# Altium project GD32E103.PrjPcb
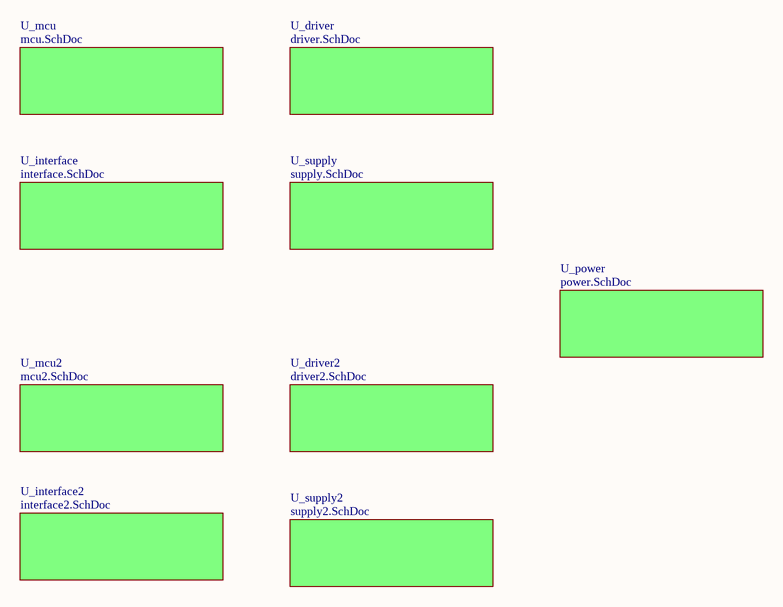
[diagram p0: GD30E103.SchDoc]
6 sheets, 250 parts. Net scope: global (net labels, ports and power ports of the same name join across sheets).
Board file: GD32E103.PcbDoc
Sheets:
  GD30E103.SchDoc
    U_mcu = mcu.SchDoc
    U_driver = driver.SchDoc
    U_interface = interface.SchDoc
    U_power = power.SchDoc
    U_supply = supply.SchDoc

## Sheet GD30E103.SchDoc
size A4

### Sub-sheets
U_driver = driver.SchDoc: no entries
U_driver2 = driver2.SchDoc (file not in this document): no entries
U_interface = interface.SchDoc: no entries
U_interface2 = interface2.SchDoc (file not in this document): no entries
U_mcu = mcu.SchDoc: no entries
U_mcu2 = mcu2.SchDoc (file not in this document): no entries
U_power = power.SchDoc: no entries
U_supply = supply.SchDoc: no entries
U_supply2 = supply2.SchDoc (file not in this document): no entries

## Sheet mcu.SchDoc
size A4
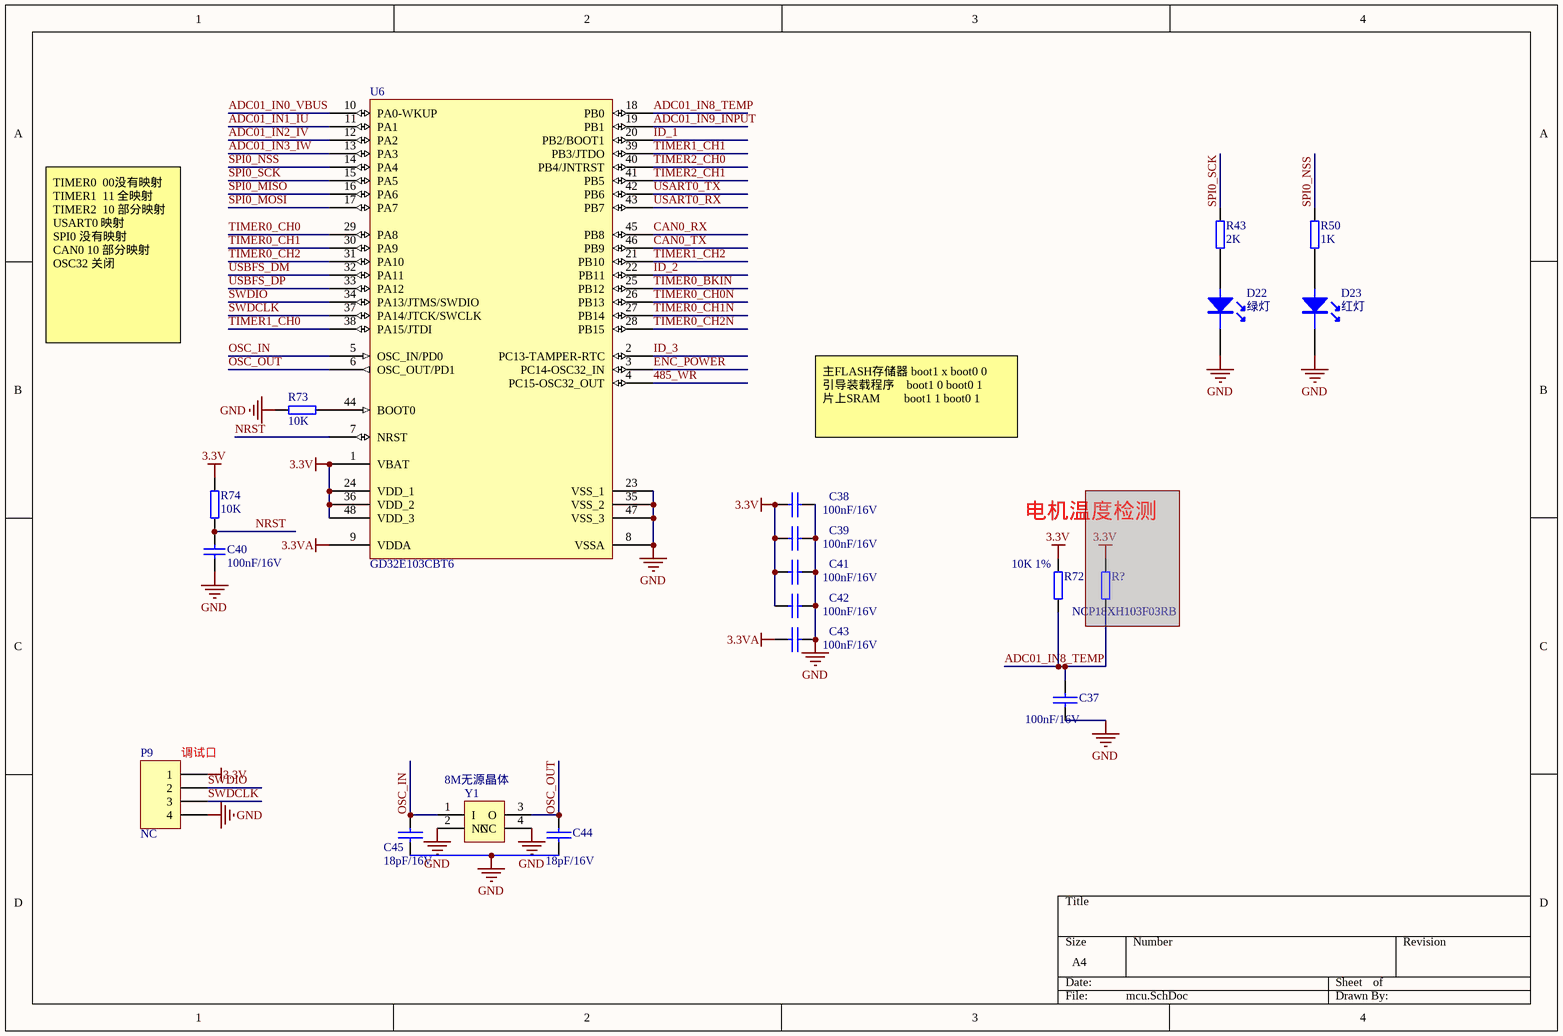
[diagram p1: mcu.SchDoc]

### Parts
C37  100nF/16V  [C0402]
C38  100nF/16V  [C0402]
C39  100nF/16V  [C0402]
C40  100nF/16V  [C0402]
C41  100nF/16V  [C0402]
C42  100nF/16V  [C0402]
C43  100nF/16V  [C0402]
C44  18pF/16V  [C0402]
C45  18pF/16V  [C0402]
D22  绿灯  [LED_0603]
D23  红灯  [LED_0603]
P9  NC  [2.0*4]
R43  2K  [R0402]
R50  1K  [R0402]
R72  10K 1%  [R0402]
R73  10K  [R0402]
R74  10K  [R0402]
R?  NCP18XH103F03RB  [R0603]  (masked out: inside a compile mask, not in the netlist)
U6  GD32E103CBT6  [LQFP-48]
Y1  8M无源晶体  [5032 4pin]

### Nets
3.3V: C38.2 C39.2 C41.2 C42.2 P9.1 R72.2 R74.2 U6.1(VBAT) U6.24(VDD_1) U6.36(VDD_2) U6.48(VDD_3)
3.3VA: C43.2 U6.9(VDDA)
GND: C37.2 C38.1 C39.1 C40.1 C41.1 C42.1 C43.1 C44.1 C45.1 D22.2(K) D23.2(K) P9.4 R73.1 U6.8(VSSA) U6.23(VSS_1) U6.35(VSS_2) U6.47(VSS_3) Y1.2(NC) Y1.4(NC)
485_WR: U6.4(PC15-OSC32_OUT)
ADC01_IN0_VBUS: U6.10(PA0-WKUP)
ADC01_IN1_IU: U6.11(PA1)
ADC01_IN2_IV: U6.12(PA2)
ADC01_IN3_IW: U6.13(PA3)
ADC01_IN8_TEMP: C37.1 R72.1 U6.18(PB0)
ADC01_IN9_INPUT: U6.19(PB1)
CAN0_RX: U6.45(PB8)
CAN0_TX: U6.46(PB9)
ENC_POWER: U6.3(PC14-OSC32_IN)
ID_1: U6.20(PB2/BOOT1)
ID_2: U6.22(PB11)
ID_3: U6.2(PC13-TAMPER-RTC)
NRST: C40.2 R74.1 U6.7(NRST)
OSC_IN: C45.2 U6.5(OSC_IN/PD0) Y1.1(I)
OSC_OUT: C44.2 U6.6(OSC_OUT/PD1) Y1.3(O)
SPI0_MISO: U6.16(PA6)
SPI0_MOSI: U6.17(PA7)
SPI0_NSS: R50.1 U6.14(PA4)
SPI0_SCK: R43.1 U6.15(PA5)
SWDCLK: P9.3 U6.37(PA14/JTCK/SWCLK)
SWDIO: P9.2 U6.34(PA13/JTMS/SWDIO)
TIMER0_BKIN: U6.25(PB12)
TIMER0_CH0: U6.29(PA8)
TIMER0_CH0N: U6.26(PB13)
TIMER0_CH1: U6.30(PA9)
TIMER0_CH1N: U6.27(PB14)
TIMER0_CH2: U6.31(PA10)
TIMER0_CH2N: U6.28(PB15)
TIMER1_CH0: U6.38(PA15/JTDI)
TIMER1_CH1: U6.39(PB3/JTDO)
TIMER1_CH2: U6.21(PB10)
TIMER2_CH0: U6.40(PB4/JNTRST)
TIMER2_CH1: U6.41(PB5)
USART0_RX: U6.43(PB7)
USART0_TX: U6.42(PB6)
USBFS_DM: U6.32(PA11)
USBFS_DP: U6.33(PA12)
NetD22_1: D22.1(A) R43.2
NetD23_1: D23.1(A) R50.2
NetR73_2: R73.2 U6.44(BOOT0)

### Notes on the sheet
- TIMER0  00没有映射
  TIMER1  11 全映射
  TIMER2  10 部分映射
  USART0 映射
  SPI0 没有映射
  CAN0 10 部分映射
  OSC32 关闭
- 主FLASH存储器 boot1 x boot0 0
  引导装载程序    boot1 0 boot0 1
  片上SRAM        boot1 1 boot0 1
- 电机温度检测
- (near P9) 调试口

### Library data of the parts
C37-C39 C41-C45 = CAP: Capacitor
C40 = cap
D22 = LED: 绿灯led
D23 = LED: 红灯led
P9 = 排针2mm,1*4: 空，无器件; LatestRevisionDate: 17-Jul-2002; LatestRevisionNote: Re-released for DXP Platform.; Publisher: Altium Limited
R43 R50 R72 = R
R73 R74 = Resistance
R? = R: 风华贴片NTC 120K 5%
U6 = GD32E103CxT6: Published: *; DatasheetVersion: *; PackageVersion: *; PackageReference: *; Publisher: *; PackageDescription: *; ComponentLink1Description: *; ComponentLink1URL: *; ComponentLink2Description: *; ComponentLink2URL: *
Y1 = OSC24

## Sheet driver.SchDoc
size A4
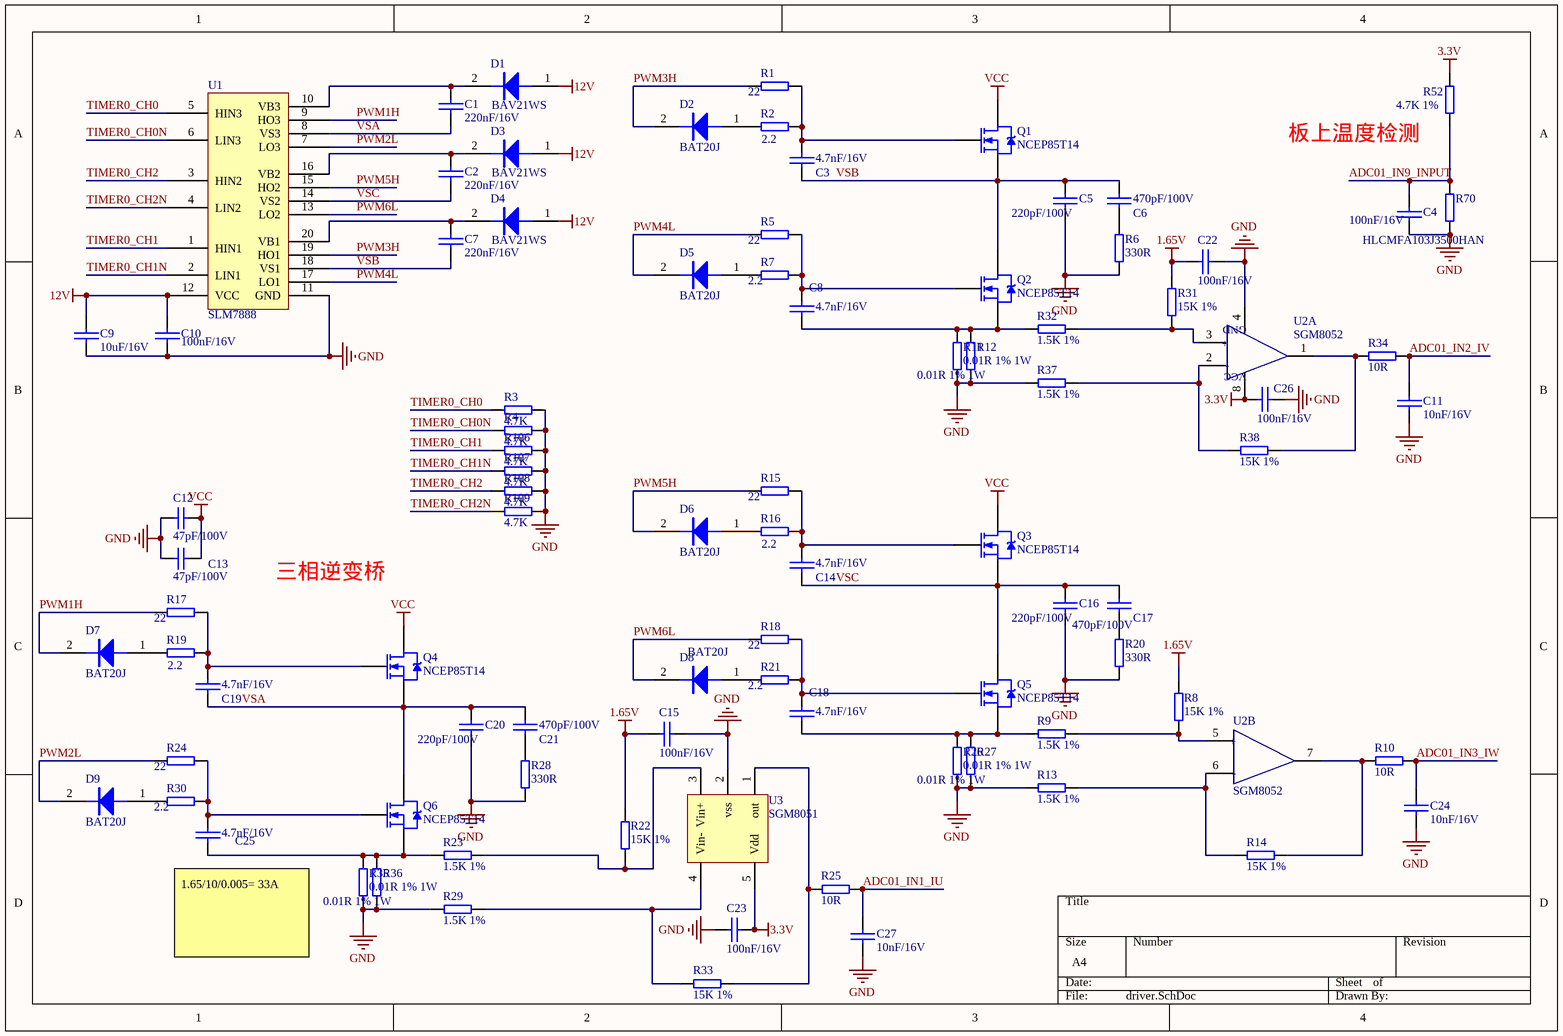
[diagram p2: driver.SchDoc]

### Parts
C1  220nF/16V  [C0402]
C2  220nF/16V  [C0402]
C3  4.7nF/16V  [C0402]
C4  100nF/16V  [C0402]
C5  220pF/100V  [C0805]
C6  470pF/100V  [C0805]
C7  220nF/16V  [C0402]
C8  4.7nF/16V  [C0402]
C9  10uF/16V  [C0805]
C10  100nF/16V  [C0603]
C11  10nF/16V  [C0402]
C12  47pF/100V  [C1206]
C13  47pF/100V  [C1206]
C14  4.7nF/16V  [C0402]
C15  100nF/16V  [C0402]
C16  220pF/100V  [C0805]
C17  470pF/100V  [C0805]
C18  4.7nF/16V  [C0402]
C19  4.7nF/16V  [C0402]
C20  220pF/100V  [C0805]
C21  470pF/100V  [C0805]
C22  100nF/16V  [C0402]
C23  100nF/16V  [C0402]
C24  10nF/16V  [C0402]
C25  4.7nF/16V  [C0402]
C26  100nF/16V  [C0402]
C27  10nF/16V  [C0402]
D1  BAV21WS  [SOD-323]
D2  BAT20J  [SOD-323]
D3  BAV21WS  [SOD-323]
D4  BAV21WS  [SOD-323]
D5  BAT20J  [SOD-323]
D6  BAT20J  [SOD-323]
D7  BAT20J  [SOD-323]
D8  BAT20J  [SOD-323]
D9  BAT20J  [SOD-323]
Q1  NCEP85T14  [TO-220ABN]
Q2  NCEP85T14  [TO-220ABN]
Q3  NCEP85T14  [TO-220ABN]
Q4  NCEP85T14  [TO-220ABN]
Q5  NCEP85T14  [TO-220ABN]
Q6  NCEP85T14  [TO-220ABN]
R1  22  [R0603]
R2  2.2  [R0603]
R3  4.7K  [R0402]
R4  4.7K  [R0402]
R5  22  [R0603]
R6  330R  [R1206]
R7  2.2  [R0603]
R8  15K 1%  [R0402]
R9  1.5K 1%  [R0402]
R10  10R  [R0402]
R11  0.01R 1% 1W  [R1210]
R12  0.01R 1% 1W  [R1210]
R13  1.5K 1%  [R0402]
R14  15K 1%  [R0402]
R15  22  [R0603]
R16  2.2  [R0603]
R17  22  [R0603]
R18  22  [R0603]
R19  2.2  [R0603]
R20  330R  [R1206]
R21  2.2  [R0603]
R22  15K 1%  [R0402]
R23  1.5K 1%  [R0402]
R24  22  [R0603]
R25  10R  [R0402]
R26  0.01R 1% 1W  [R1210]
R27  0.01R 1% 1W  [R1210]
R28  330R  [R1206]
R29  1.5K 1%  [R0402]
R30  2.2  [R0603]
R31  15K 1%  [R0402]
R32  1.5K 1%  [R0402]
R33  15K 1%  [R0402]
R34  10R  [R0402]
R35  0.01R 1% 1W  [R1210]
R36  0.01R 1% 1W  [R1210]
R37  1.5K 1%  [R0402]
R38  15K 1%  [R0402]
R52  4.7K 1%  [R0402]
R70  HLCMFA103J3500HAN  [R0603]
R106  4.7K  [R0402]
R107  4.7K  [R0402]
R108  4.7K  [R0402]
R109  4.7K  [R0402]
U1  SLM7888  [TSSOP-20]
U2  SGM8052  [VSSOP/MSOP-8]  (parts A,B of 2)
U3  SGM8051  [SOT-23(5)]

### Nets
1.65V: C15.2 C22.2 R8.1 R22.1 R31.1
3.3V: C23.2 C26.2 R52.2 U2.8(VCC) U3.5(Vdd)
12V: C9.2 C10.2 D1.1(A) D3.1(A) D4.1(A) U1.12(VCC)
GND: C4.2 C5.1 C9.1 C10.1 C11.2 C12.2 C13.2 C15.1 C16.1 C20.1 C22.1 C23.1 C24.2 C26.1 C27.2 R3.2 R4.2 R6.1 R11.2 R12.2 R13.2 R20.1 R26.2 R27.2 R28.1 R29.2 R35.2 R36.2 R37.2 R70.1 R106.2 R107.2 R108.2 R109.2 U1.11(GND) U2.4(GND) U3.2(vss)
VCC: C12.1 C13.1 Q1.3(D) Q3.3(D) Q4.3(D)
ADC01_IN1_IU: C27.1 R25.1
ADC01_IN2_IV: C11.1 R34.1
ADC01_IN3_IW: C24.1 R10.1
ADC01_IN9_INPUT: C4.1 R52.1 R70.2
PWM1H: D7.2(K) R17.2 U1.9(HO3)
PWM2L: D9.2(K) R24.2 U1.7(LO3)
PWM3H: D2.2(K) R1.2 U1.19(HO1)
PWM4L: D5.2(K) R5.2 U1.17(LO1)
PWM5H: D6.2(K) R15.2 U1.15(HO2)
PWM6L: D8.2(K) R18.2 U1.13(LO2)
TIMER0_CH0: R3.1 U1.5(HIN3)
TIMER0_CH0N: R4.1 U1.6(LIN3)
TIMER0_CH1: R106.1 U1.1(HIN1)
TIMER0_CH1N: R107.1 U1.2(LIN1)
TIMER0_CH2: R108.1 U1.3(HIN2)
TIMER0_CH2N: R109.1 U1.4(LIN2)
VSA: C1.1 C19.2 C20.2 C21.1 Q4.2(S) Q6.3(D) U1.8(VS3)
VSB: C3.2 C5.2 C6.1 C7.1 Q1.2(S) Q2.3(D) U1.18(VS1)
VSC: C2.1 C14.2 C16.2 C17.1 Q3.2(S) Q5.3(D) U1.14(VS2)
NetC1_2: C1.2 D1.2(K) U1.10(VB3)
NetC2_2: C2.2 D3.2(K) U1.16(VB2)
NetC3_1: C3.1 Q1.1(G) R1.1 R2.2
NetC6_2: C6.2 R6.2
NetC7_2: C7.2 D4.2(K) U1.20(VB1)
NetC8_1: C8.1 Q2.1(G) R5.1 R7.2
NetC8_2: C8.2 Q2.2(S) R11.1 R12.1 R32.2
NetC14_1: C14.1 Q3.1(G) R15.1 R16.2
NetC17_2: C17.2 R20.2
NetC18_1: C18.1 Q5.1(G) R18.1 R21.2
NetC18_2: C18.2 Q5.2(S) R9.2 R26.1 R27.1
NetC19_1: C19.1 Q4.1(G) R17.1 R19.2
NetC21_2: C21.2 R28.2
NetC25_1: C25.1 Q6.1(G) R24.1 R30.2
NetC25_2: C25.2 Q6.2(S) R23.2 R35.1 R36.1
NetD2_1: D2.1(A) R2.1
NetD5_1: D5.1(A) R7.1
NetD6_1: D6.1(A) R16.1
NetD7_1: D7.1(A) R19.1
NetD8_1: D8.1(A) R21.1
NetD9_1: D9.1(A) R30.1
NetR8_2: R8.2 R9.1 U2.5(+)
NetR10_2: R10.2 R14.1 U2.7(OUT2)
NetR13_1: R13.1 R14.2 U2.6(-)
NetR22_2: R22.2 R23.1 U3.3(Vin+)
NetR25_2: R25.2 R33.1 U3.1(out)
NetR29_1: R29.1 R33.2 U3.4(Vin-)
NetR31_2: R31.2 R32.1 U2.3(-)
NetR34_2: R34.2 R38.1 U2.1(OUT1)
NetR37_1: R37.1 R38.2 U2.2(-)

### Notes on the sheet
- 板上温度检测
- 三相逆变桥
- (near C25) 1.65/10/0.005= 33A

### Library data of the parts
C1-C11 C14-C27 = CAP: Capacitor
C12 C13 = cap
D1-D9 = DIODE
Q1-Q6 = N-channel Enhancement MOS
R1-R5 R7 R15-R19 R21 R24 R30 R52 R70 R106-R109 = R
R6 R8-R14 R20 R22 R23 R25-R29 R31-R38 = Resistance
U1 = SLM7888: SILLUMIN
U2 = LM393: 圣邦微电子
U3 = LMV7239: 圣邦微电子

## Sheet interface.SchDoc
size A4
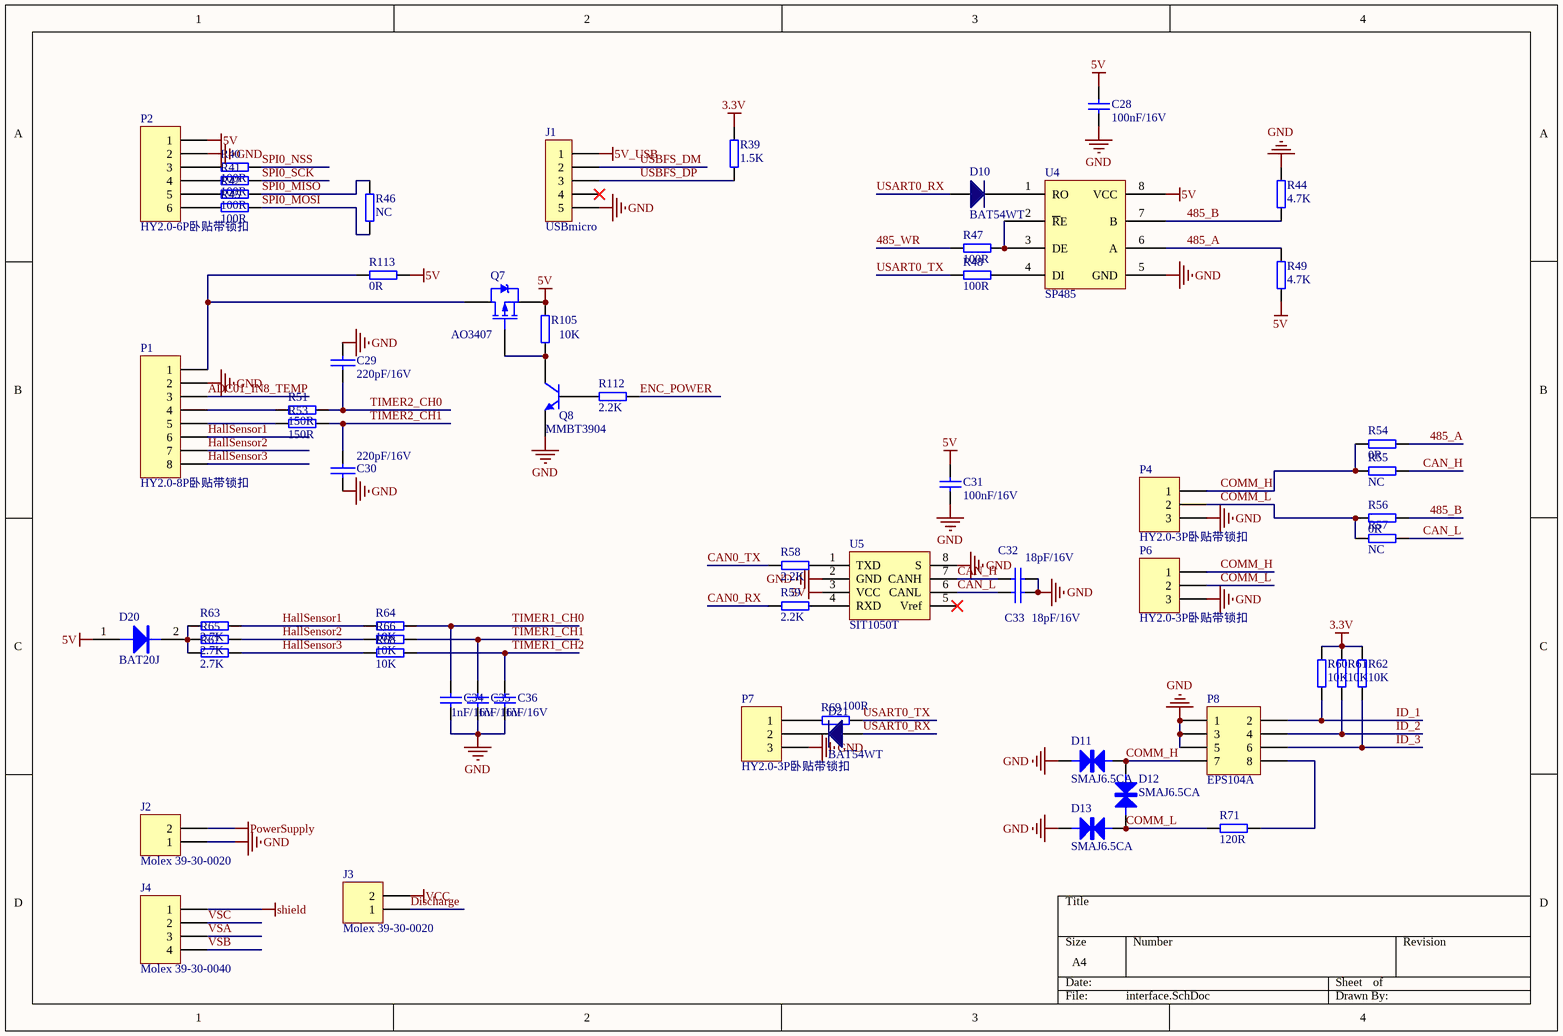
[diagram p3: interface.SchDoc]

### Parts
C28  100nF/16V  [C0402]
C29  220pF/16V  [C0402]
C30  220pF/16V  [C0402]
C31  100nF/16V  [C0402]
C32  18pF/16V  [C0402]
C33  18pF/16V  [C0402]
C34  1nF/16V  [C0402]
C35  1nF/16V  [C0402]
C36  1nF/16V  [C0402]
D10  BAT54WT  [SOD-523/SC-79]
D11  SMAJ6.5CA  [DO-214AC SMA]
D12  SMAJ6.5CA  [DO-214AC SMA]
D13  SMAJ6.5CA  [DO-214AC SMA]
D20  BAT20J  [SOD-323]
D21  BAT54WT  [SOD-523/SC-79]
J1  USBmicro  [USBmicro]
J2  Molex 39-30-0020  [Molex 39-30-0020]
J3  Molex 39-30-0020  [Molex 39-30-0020]
J4  Molex 39-30-0040  [Molex 39-30-0040]
P1  HY2.0-8P卧贴带锁扣  [2.0-8PIN 卧式]
P2  HY2.0-6P卧贴带锁扣  [2.0-6PIN 卧式]
P4  HY2.0-3P卧贴带锁扣  [2.0-3PIN 卧式]
P6  HY2.0-3P卧贴带锁扣  [2.0-3PIN 卧式]
P7  HY2.0-3P卧贴带锁扣  [2.0-3PIN 卧式]
P8  EPS104A  [EPG104A]
Q7  AO3407  [SOT-23]
Q8  MMBT3904  [SOT-23]
R39  1.5K  [R0402]
R40  100R  [R0402]
R41  100R  [R0402]
R42  100R  [R0402]
R44  4.7K  [R0402]
R45  100R  [R0402]
R46  NC  [R0603]
R47  100R  [R0402]
R48  100R  [R0402]
R49  4.7K  [R0402]
R51  150R  [R0402]
R53  150R  [R0402]
R54  0R  [R0603]
R55  NC  [R0603]
R56  0R  [R0603]
R57  NC  [R0603]
R58  2.2K  [R0402]
R59  2.2K  [R0402]
R60  10K  [R0402]
R61  10K  [R0402]
R62  10K  [R0402]
R63  2.7K  [R0402]
R64  10K  [R0402]
R65  2.7K  [R0402]
R66  10K  [R0402]
R67  2.7K  [R0402]
R68  10K  [R0402]
R69  100R  [R0402]
R71  120R  [R0603]
R105  10K  [R0402]
R112  2.2K  [R0402]
R113  0R  [R0805]
U4  SP485  [SOIC-8]
U5  SIT1050T  [SOIC-8]

### Nets
3.3V: R39.2 R60.2 R61.2 R62.2
5V: C28.1 C31.1 D20.1(A) P2.1 Q7.2(S) R49.1 R105.2 R113.2 U4.8(VCC) U5.3(VCC)
5V_USB: J1.1
GND: C28.2 C29.2 C30.1 C31.2 C32.1 C33.1 C34.2 C35.2 C36.2 D11.1(Anode) D13.1(Anode) J1.5 J2.1 P1.2 P2.2 P4.3 P6.3 P7.3 P8.1 P8.3 P8.5 Q8.2(E) R44.2 U4.5(GND) U5.2(GND) U5.8(S)
PowerSupply: J2.2
shield: J4.1
VCC: J3.2
485_A: R49.2 R54.1 U4.6(A)
485_B: R44.1 R56.1 U4.7(B)
485_WR: R47.2
ADC01_IN8_TEMP: P1.3
CAN0_RX: R59.2
CAN0_TX: R58.2
CAN_H: C32.2 R55.1 U5.7(CANH)
CAN_L: C33.2 R57.1 U5.6(CANL)
COMM_H: D11.2(Anode) D12.1(Anode) P4.1 P6.1 P8.7 R54.2 R55.2
COMM_L: D12.2(Anode) D13.2(Anode) P4.2 P6.2 R56.2 R57.2 R71.2
Discharge: J3.1
ENC_POWER: R112.2
HallSensor1: P1.6 R63.1 R64.1
HallSensor2: P1.7 R65.1 R66.1
HallSensor3: P1.8 R67.1 R68.1
ID_1: P8.2 R60.1
ID_2: P8.4 R61.1
ID_3: P8.6 R62.1
SPI0_MISO: R42.1 R46.1
SPI0_MOSI: R45.1 R46.2
SPI0_NSS: R40.1
SPI0_SCK: R41.1
TIMER1_CH0: C34.1 R64.2
TIMER1_CH1: C35.1 R66.2
TIMER1_CH2: C36.1 R68.2
TIMER2_CH0: C29.1 R51.2
TIMER2_CH1: C30.2 R53.2
USART0_RX: D10.1 D21.1
USART0_TX: R48.2 R69.1
USBFS_DM: J1.2
USBFS_DP: J1.3 R39.1
VSA: J4.3
VSB: J4.4
VSC: J4.2
NetD10_2: D10.2 U4.1(RO)
NetD20_2: D20.2(K) R63.2 R65.2 R67.2
NetD21_2: D21.2 P7.2
NetP1_1: P1.1 Q7.3(D) R113.1
NetP1_4: P1.4 R51.1
NetP1_5: P1.5 R53.1
NetP2_3: P2.3 R40.2
NetP2_4: P2.4 R41.2
NetP2_5: P2.5 R42.2
NetP2_6: P2.6 R45.2
NetP7_1: P7.1 R69.2
NetP8_8: P8.8 R71.1
NetQ7_1: Q7.1(G) Q8.3(C) R105.1
NetQ8_1: Q8.1(B) R112.1
NetR47_1: R47.1 U4.2(~{R}E) U4.3(DE)
NetR48_1: R48.1 U4.4(DI)
NetR58_1: R58.1 U5.1(TXD)
NetR59_1: R59.1 U5.4(RXD)

Not connected (* = marked no-connect by the designer): J1 4*; U5 5(Vref)*

### Library data of the parts
C28 C31-C36 = cap
C29 C30 = CAP: Capacitor
D10 D21 = Diode
D11-D13 = Bi-DIODES
D20 = DIODE
J1 = CON5: USB micro母座
J2 J3 = Header 2: Header, 2-Pin; LatestRevisionDate: 17-Jul-2002; LatestRevisionNote: Re-released for DXP Platform.; Publisher: Altium Limited
J4 = Header 4: Header, 4-Pin; LatestRevisionDate: 17-Jul-2002; LatestRevisionNote: Re-released for DXP Platform.; Publisher: Altium Limited
P1 = Header 8: LatestRevisionDate: 17-Jul-2002; LatestRevisionNote: Re-released for DXP Platform.; Publisher: Altium Limited
P2 = Header 6: LatestRevisionDate: 17-Jul-2002; LatestRevisionNote: Re-released for DXP Platform.; Publisher: Altium Limited
P4 P6 P7 = Header 3: LatestRevisionDate: 17-Jul-2002; LatestRevisionNote: Re-released for DXP Platform.; Publisher: Altium Limited
P8 = Header 4X2: 侧拨程式开关 2.54间距 4PIN 品牌：台湾ECE; LatestRevisionDate: 17-Jul-2002; LatestRevisionNote: Re-released for DXP Platform.; Publisher: Altium Limited
Q7 = P-channel Enhancement MOS
Q8 = NPN
R39-R42 R44-R49 R51 R53-R69 R71 R105 R112 R113 = Resistance
U5 = TJA1050

## Sheet power.SchDoc
size A4
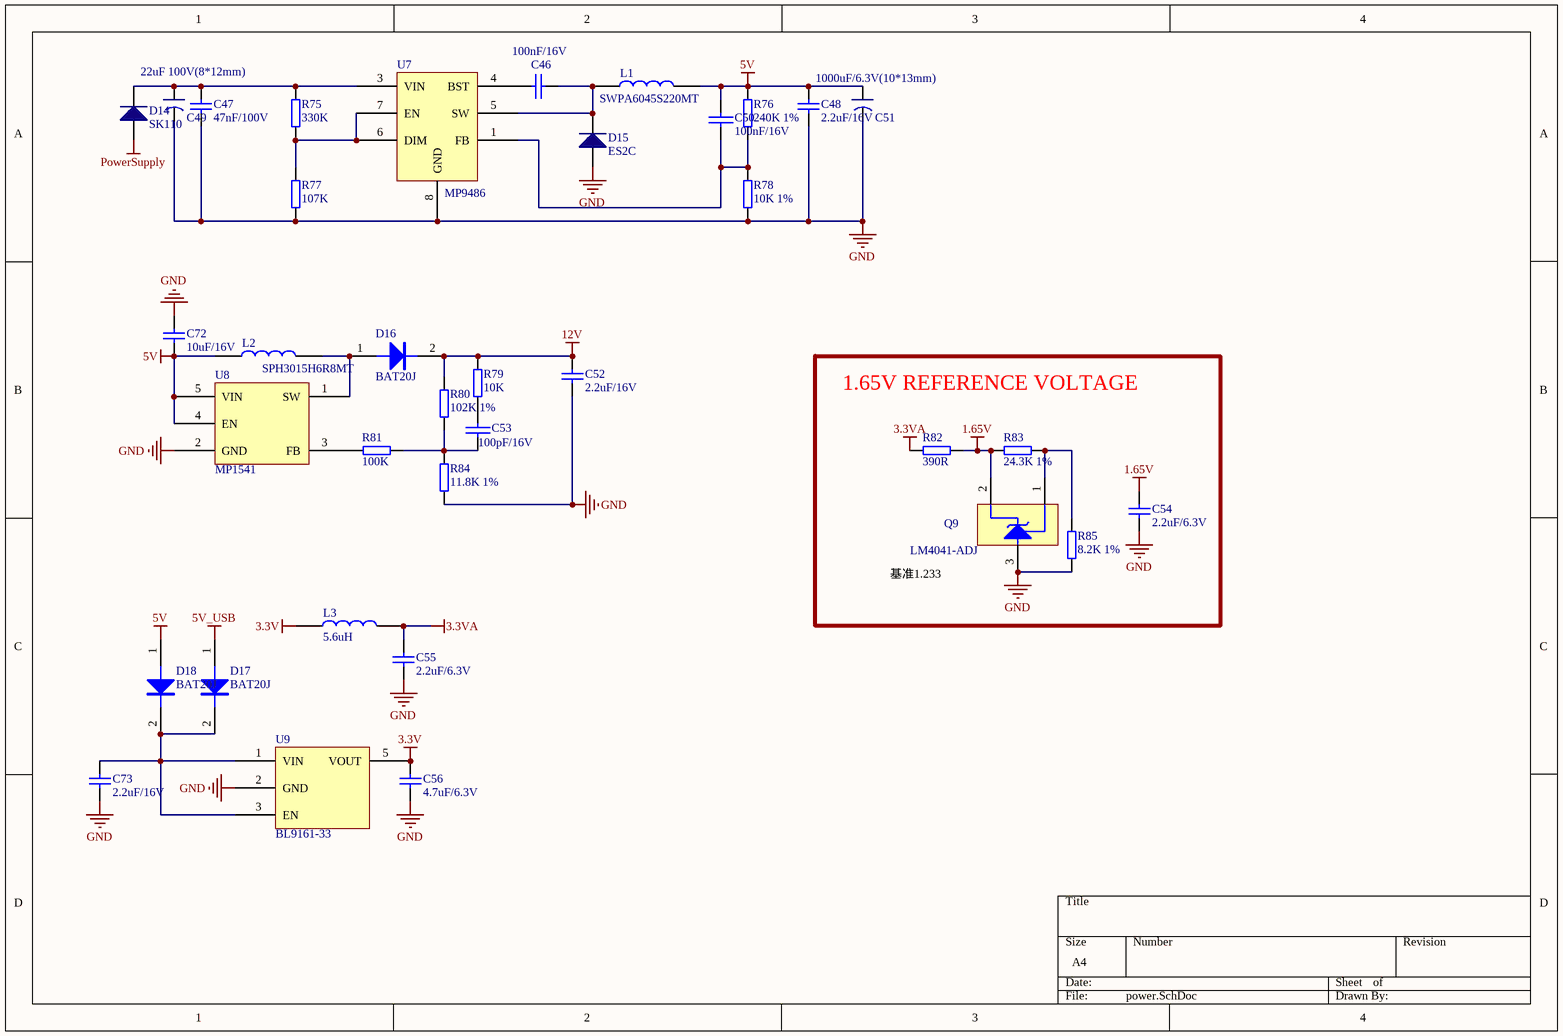
[diagram p4: power.SchDoc]

### Parts
C46  100nF/16V  [C0402]
C47  47nF/100V  [C1206]
C48  2.2uF/16V  [C0603]
C49  22uF 100V(8*12mm)  [AL-ELEC 8*12mm]
C50  100nF/16V  [C0402]
C51  1000uF/6.3V(10*13mm)  [AL-ELEC 10*13mm]
C52  2.2uF/16V  [C0603]
C53  100pF/16V  [C0402]
C54  2.2uF/6.3V  [C0402]
C55  2.2uF/6.3V  [C0402]
C56  4.7uF/6.3V  [C0603]
C72  10uF/16V  [C0805]
C73  2.2uF/16V  [C0603]
D14  SK110  [DO-214AC SMA]
D15  ES2C  [DO-214AA SMB]
D16  BAT20J  [SOD-323]
D17  BAT20J  [SOD-323]
D18  BAT20J  [SOD-323]
L1  SWPA6045S220MT  [SWPA6045S]
L2  SPH3015H6R8MT  [SPH3015]
L3  5.6uH  [L0402]
Q9  LM4041-ADJ  [SOT-23]
R75  330K  [R0402]
R76  240K 1%  [R0402]
R77  107K  [R0402]
R78  10K 1%  [R0402]
R79  10K  [R0402]
R80  102K 1%  [R0402]
R81  100K  [R0402]
R82  390R  [R0603]
R83  24.3K 1%  [R0402]
R84  11.8K 1%  [R0402]
R85  8.2K 1%  [R0402]
U7  MP9486  [SOIC-8 EP]
U8  MP1541  [SOT-23(5)]
U9  BL9161-33  [SOT-23(5)]

### Blocks framed on the sheet
1.65V REFERENCE VOLTAGE: C54 Q9 R82 R83 R85

### Nets
1.65V: C54.2 Q9.2 R82.2 R83.1
3.3V: C56.2 L3.1 U9.5(VOUT)
3.3VA: C55.2 L3.2 R82.1
5V: C48.2 C50.1 C51.1 C72.1 D18.1(A) L1.2 L2.1 R76.1 U8.4(EN) U8.5(VIN)
5V_USB: D17.1(A)
12V: C52.2 D16.2(K) R79.1 R80.1
GND: C47.1 C48.1 C49.2 C51.2 C52.1 C54.1 C55.1 C56.1 C72.2 C73.1 D15.1 Q9.3 R77.2 R78.2 R84.2 R85.2 U7.8(GND) U8.2(GND) U9.2(GND)
PowerSupply: D14.1
NetC46_1: C46.1 D15.2 L1.1 U7.5(SW)
NetC46_2: C46.2 U7.4(BST)
NetC47_2: C47.2 C49.1 D14.2 R75.1 U7.3(VIN)
NetC50_2: C50.2 R76.2 R78.1 U7.1(FB)
NetC53_1: C53.1 R80.2 R81.2 R84.1
NetC53_2: C53.2 R79.2
NetC73_2: C73.2 D17.2(K) D18.2(K) U9.1(VIN) U9.3(EN)
NetD16_1: D16.1(A) L2.2 U8.1(SW)
NetQ9_1: Q9.1 R83.2 R85.1
NetR75_2: R75.2 R77.1 U7.6(DIM) U7.7(EN)
NetR81_1: R81.1 U8.3(FB)

### Notes on the sheet
- (near Q9) 基准1.233

### Library data of the parts
C46 C50 C53 = CAP: Capacitor
C47 C48 C52 C54-C56 C72 C73 = cap
C49 C51 = Capacitor: 铝电解电容
D14 D15 = Diode
D16-D18 = DIODE
L1 = INDUCTOR: 顺络 22uH
L2 = INDUCTOR: 顺络 6.8uH
L3 = INDUCTOR: 贴片电感
Q9 = 3CCCCCC
R75-R85 = Resistance
U9 = BL9161

## Sheet supply.SchDoc
size A4
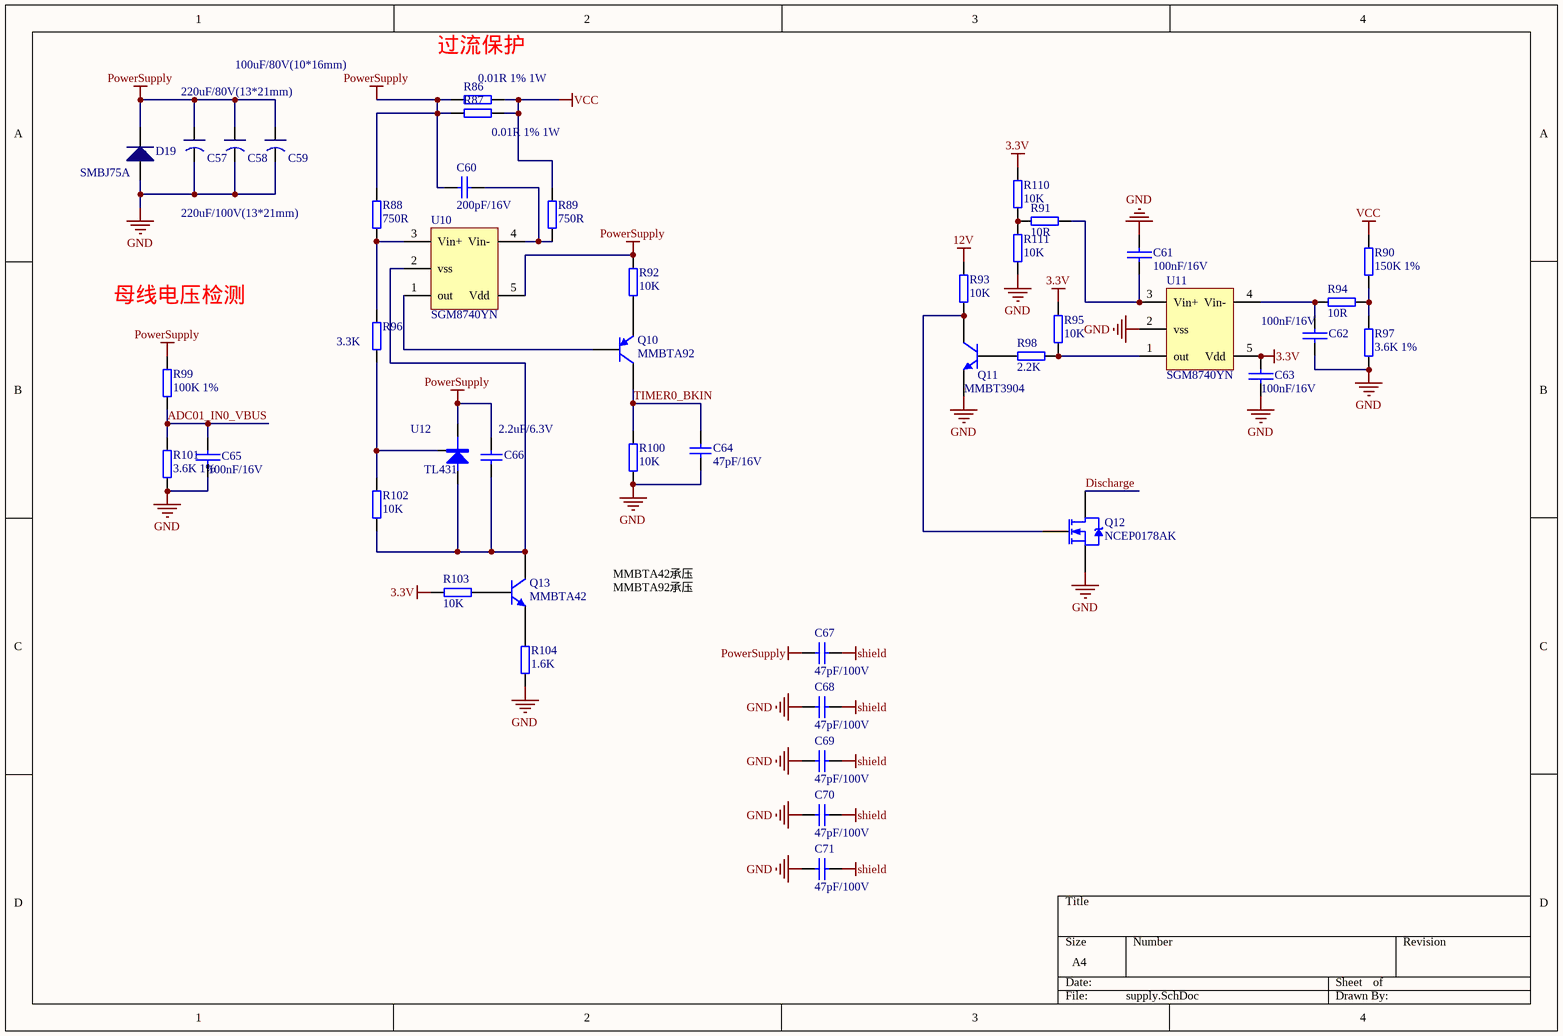
[diagram p5: supply.SchDoc]

### Parts
C57  220uF/80V(13*21mm)  [AL-ELEC 13*21mm]
C58  220uF/100V(13*21mm)  [AL-ELEC 13*21mm]
C59  100uF/80V(10*16mm)  [AL-ELEC 10*16mm]
C60  200pF/16V  [C0402]
C61  100nF/16V  [C0402]
C62  100nF/16V  [C0402]
C63  100nF/16V  [C0402]
C64  47pF/16V  [C0402]
C65  100nF/16V  [C0402]
C66  2.2uF/6.3V  [C0402]
C67  47pF/100V  [C1206]
C68  47pF/100V  [C1206]
C69  47pF/100V  [C1206]
C70  47pF/100V  [C1206]
C71  47pF/100V  [C1206]
D19  SMBJ75A  [DO-214AA SMB]
Q10  MMBTA92  [SOT-23]
Q11  MMBT3904  [SOT-23]
Q12  NCEP0178AK  [D-PAK(TO-252AA)]
Q13  MMBTA42  [SOT-23]
R86  0.01R 1% 1W  [R1210]
R87  0.01R 1% 1W  [R1210]
R88  750R  [R0402]
R89  750R  [R0402]
R90  150K 1%  [R0603]
R91  10R  [R0402]
R92  10K  [R0402]
R93  10K  [R0402]
R94  10R  [R0402]
R95  10K  [R0402]
R96  3.3K  [R0402]
R97  3.6K 1%  [R0603]
R98  2.2K  [R0402]
R99  100K 1%  [R0603]
R100  10K  [R0402]
R101  3.6K 1%  [R0603]
R102  10K  [R0402]
R103  10K  [R0402]
R104  1.6K  [R0402]
R110  10K  [R0402]
R111  10K  [R0402]
U10  SGM8740YN  [SOT-23(5)]
U11  SGM8740YN  [SOT-23(5)]
U12  TL431  [SOT-23]

### Nets
3.3V: C63.1 R95.2 R103.1 R110.2 U11.5(Vdd)
12V: R93.2
GND: C57.2 C58.2 C59.2 C61.2 C62.2 C63.2 C64.2 C65.2 C68.2 C69.2 C70.2 C71.2 D19.1 Q11.2(E) Q12.2(S) R97.1 R100.1 R101.1 R104.1 R111.1 U11.2(vss)
PowerSupply: C57.1 C58.1 C59.1 C60.2 C66.1 C67.2 D19.2 R86.2 R87.2 R88.2 R92.2 R99.2 U10.5(Vdd) U12.1(Cathode)
shield: C67.1 C68.1 C69.1 C70.1 C71.1
VCC: R86.1 R87.1 R89.2 R90.2
ADC01_IN0_VBUS: C65.1 R99.1 R101.2
Discharge: Q12.3(D)
TIMER0_BKIN: C64.1 Q10.3(C) R100.2
NetC60_1: C60.1 R89.1 U10.4(Vin-)
NetC61_1: C61.1 R91.1 U11.3(Vin+)
NetC62_1: C62.1 R94.2 U11.4(Vin-)
NetC66_2: C66.2 Q13.3(C) R102.2 U10.2(vss) U12.3(Anode)
NetQ10_1: Q10.1(B) U10.1(out)
NetQ10_2: Q10.2(E) R92.1
NetQ11_1: Q11.1(B) R98.1
NetQ11_3: Q11.3(C) Q12.1(G) R93.1
NetQ13_1: Q13.1(B) R103.2
NetQ13_2: Q13.2(E) R104.2
NetR88_1: R88.1 R96.1 U10.3(Vin+)
NetR90_1: R90.1 R94.1 R97.2
NetR91_2: R91.2 R110.1 R111.2
NetR95_1: R95.1 R98.2 U11.1(out)
NetR96_2: R96.2 R102.1 U12.2(REF)

### Notes on the sheet
- 过流保护
- 母线电压检测
- MMBTA42承压MMBTA92承压

### Library data of the parts
C57-C59 = Capacitor: 铝电解电容
C60 C64 C66-C71 = cap
C61-C63 C65 = CAP: Capacitor
D19 = Diode
Q10 = PNP
Q11 Q13 = NPN
Q12 = N-channel Enhancement MOS
R86-R104 R110 R111 = Resistance
U10 U11 = LMV7239: 圣邦微电子 丝印 SL5XX
U12 = TL431A: 注意引脚关系：1-C 2-R 3-A

## Nets that join several sheets
1.65V: driver (5 pins), power (C54.2 Q9.2 R82.2 R83.1)
3.3V: mcu (11 pins), driver (5 pins), interface (R39.2 R60.2 R61.2 R62.2), power (C56.2 L3.1 U9.5), supply (5 pins)
3.3VA: mcu (C43.2 U6.9), power (C55.2 L3.2 R82.1)
5V: interface (10 pins), power (10 pins)
5V_USB: interface (J1.1), power (D17.1)
12V: driver (6 pins), power (C52.2 D16.2 R79.1 R80.1), supply (R93.2)
GND: mcu (19 pins), driver (37 pins), interface (26 pins), power (19 pins), supply (21 pins)
PowerSupply: interface (J2.2), power (D14.1), supply (14 pins)
shield: interface (J4.1), supply (5 pins)
VCC: driver (5 pins), interface (J3.2), supply (R86.1 R87.1 R89.2 R90.2)
485_WR: mcu (U6.4), interface (R47.2)
ADC01_IN0_VBUS: mcu (U6.10), supply (C65.1 R99.1 R101.2)
ADC01_IN1_IU: mcu (U6.11), driver (C27.1 R25.1)
ADC01_IN2_IV: mcu (U6.12), driver (C11.1 R34.1)
ADC01_IN3_IW: mcu (U6.13), driver (C24.1 R10.1)
ADC01_IN8_TEMP: mcu (C37.1 R72.1 U6.18), interface (P1.3)
ADC01_IN9_INPUT: mcu (U6.19), driver (C4.1 R52.1 R70.2)
CAN0_RX: mcu (U6.45), interface (R59.2)
CAN0_TX: mcu (U6.46), interface (R58.2)
Discharge: interface (J3.1), supply (Q12.3)
ENC_POWER: mcu (U6.3), interface (R112.2)
ID_1: mcu (U6.20), interface (P8.2 R60.1)
ID_2: mcu (U6.22), interface (P8.4 R61.1)
ID_3: mcu (U6.2), interface (P8.6 R62.1)
SPI0_MISO: mcu (U6.16), interface (R42.1 R46.1)
SPI0_MOSI: mcu (U6.17), interface (R45.1 R46.2)
SPI0_NSS: mcu (R50.1 U6.14), interface (R40.1)
SPI0_SCK: mcu (R43.1 U6.15), interface (R41.1)
TIMER0_BKIN: mcu (U6.25), supply (C64.1 Q10.3 R100.2)
TIMER0_CH0: mcu (U6.29), driver (R3.1 U1.5)
TIMER0_CH0N: mcu (U6.26), driver (R4.1 U1.6)
TIMER0_CH1: mcu (U6.30), driver (R106.1 U1.1)
TIMER0_CH1N: mcu (U6.27), driver (R107.1 U1.2)
TIMER0_CH2: mcu (U6.31), driver (R108.1 U1.3)
TIMER0_CH2N: mcu (U6.28), driver (R109.1 U1.4)
TIMER1_CH0: mcu (U6.38), interface (C34.1 R64.2)
TIMER1_CH1: mcu (U6.39), interface (C35.1 R66.2)
TIMER1_CH2: mcu (U6.21), interface (C36.1 R68.2)
TIMER2_CH0: mcu (U6.40), interface (C29.1 R51.2)
TIMER2_CH1: mcu (U6.41), interface (C30.2 R53.2)
USART0_RX: mcu (U6.43), interface (D10.1 D21.1)
USART0_TX: mcu (U6.42), interface (R48.2 R69.1)
USBFS_DM: mcu (U6.32), interface (J1.2)
USBFS_DP: mcu (U6.33), interface (J1.3 R39.1)
VSA: driver (7 pins), interface (J4.3)
VSB: driver (7 pins), interface (J4.4)
VSC: driver (7 pins), interface (J4.2)